# Altium project 盖革计数器.PrjPcb
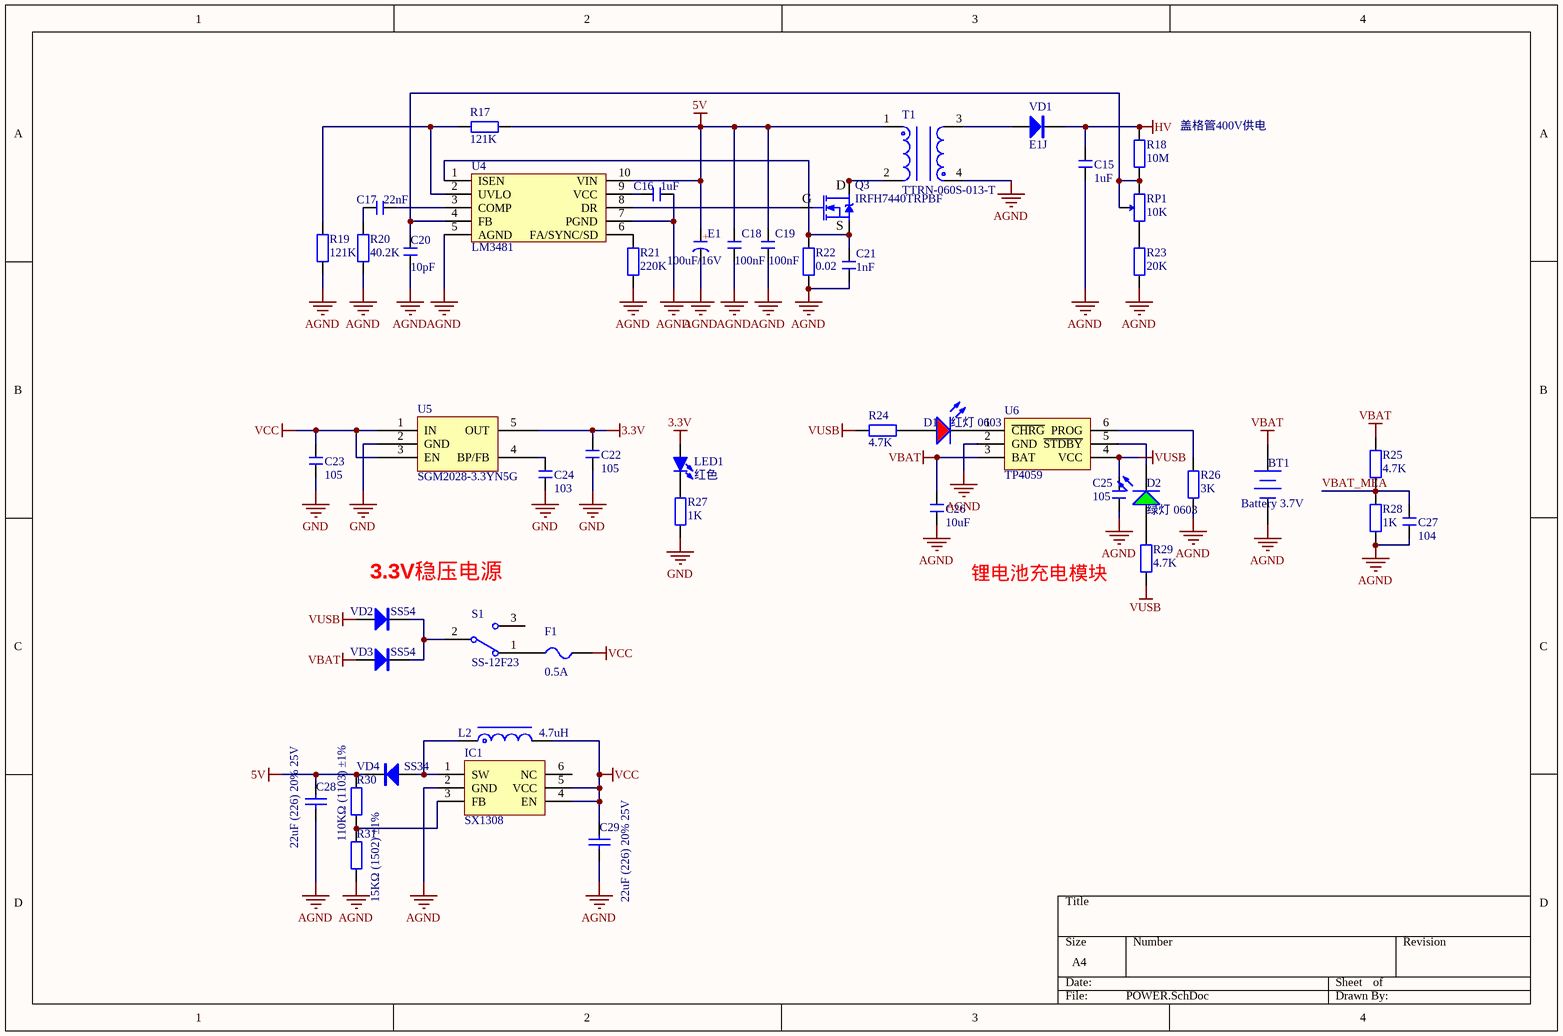
[diagram p0: POWER.SchDoc]
2 sheets, 95 parts. Net scope: global (net labels, ports and power ports of the same name join across sheets).
Board file: 盖革计数器.PcbDoc
Sheets:
  POWER.SchDoc
  CORE.SchDoc

## Sheet POWER.SchDoc
size A4

### Parts
BT1  Battery 3.7V  [BAT-2]
C15  1uF  [C 1812]
C16  1uF  [C 0603]
C17  22nF  [C 0603]
C18  100nF  [C 0603]
C19  100nF  [C 0603]
C20  10pF  [C 0603]
C21  1nF  [C 0603]
C22  105  [C 0603]
C23  105  [C 0603]
C24  103  [C 0603]
C25  105  [C 0603]
C26  10uF  [C 0805]
C27  104  [C 0603]
C28  22uF (226) 20% 25V  [0805_C]
C29  22uF (226) 20% 25V  [0805_C]
D1  红灯 0603  [0603_LED_S1]
D2  绿灯 0603  [0603_LED_S1]
E1  100uF/16V  [CM D(6.3*5.4)]
F1  0.5A  [FU 0805]
IC1  SX1308  [SOT23-6N]
L2  4.7uH  [L 04020]
LED1  红色  [LED 0603W]
Q3  IRFH7440TRPBF  [PQFN8_5X6_B_INF]
R17  121K  [R 0603]
R18  10M  [R 0603]
R19  121K  [R 0603]
R20  40.2K  [R 0603]
R21  220K  [R 0603]
R22  0.02  [R 0805]
R23  20K  [R 0603]
R24  4.7K  [R 0603]
R25  4.7K  [R 0603]
R26  3K  [R 0603]
R27  1K  [R 0603]
R28  1K  [R 0603]
R29  4.7K  [R 0603]
R30  110KΩ (1103) ±1%  [0603_R]
R31  15KΩ (1502) ±1%  [0603_R]
RP1  10K  [3303W]
S1  SS-12F23  [SS-12D07]
T1  TTRN-060S-013-T  [EE5.0]
U4  LM3481  [VSSOP10]
U5  SGM2028-3.3YN5G  [SOT23-5]
U6  TP4059  [SOT23-6_N]
VD1  E1J  [SOD-123F]
VD2  SS54  [SMA]
VD3  SS54  [SMA]
VD4  SS34  [SMA]

### Nets
3.3V: C22.2 LED1.1(A) U5.5(OUT)
5V: C18.2 C19.2 C28.2 E1.1(A) R17.1 R30.2 T1.1 U4.10(VIN) VD4.2(K)
AGND: BT1.2(-) C15.1 C16.2 C18.1 C19.1 C20.1 C21.1 C25.1 C26.1 C27.1 C28.1 C29.1 E1.2(K) IC1.2(GND) R19.1 R20.1 R21.1 R22.1 R23.1 R26.2 R28.1 R31.1 T1.4 U4.5(AGND) U4.7(PGND) U6.2(GND)
GND: C22.1 C23.1 C24.2 R27.2 U5.2(GND)
HV: C15.2 R18.2 VD1.2(K)
VBAT: BT1.1(+) C26.2 R25.2 U6.3(BAT) VD3.1(A)
VCC: C23.2 C29.2 F1.2 IC1.4(EN) IC1.5(VCC) L2.2 U5.1(IN) U5.3(EN)
VUSB: C25.2 R24.2 R29.2 U6.4(VCC) VD2.1(A)
VBAT_MEA: C27.2 R25.1 R28.2
NetC16_1: C16.1 U4.9(VCC)
NetC17_1: C17.1 R20.2
NetC17_2: C17.2 U4.3(COMP)
NetC20_2: C20.2 R18.1 RP1.1 RP1.2 U4.4(FB)
NetC21_2: C21.2 Q3.1(S) Q3.2(S) Q3.3(S) R22.2 U4.1(ISEN)
NetC24_1: C24.1 U5.4(BP/FB)
NetD1_A: D1.A R24.1
NetD1_K: D1.K U6.1(~{CHRG})
NetD2_A: D2.A R29.1
NetD2_K: D2.K U6.5(~{STDBY})
NetF1_1: F1.1 S1.1
NetIC1_1: IC1.1(SW) L2.1 VD4.1(A)
NetIC1_3: IC1.3(FB) R30.1 R31.2
NetLED1_2: LED1.2(K) R27.1
NetQ3_4: Q3.4(G) U4.8(DR)
NetQ3_5: Q3.5(D) Q3.6(D) Q3.7(D) Q3.8(D) T1.2
NetR17_2: R17.2 R19.2 U4.2(UVLO)
NetR21_2: R21.2 U4.6(FA/SYNC/SD)
NetR23_2: R23.2 RP1.3
NetR26_1: R26.1 U6.6(PROG)
NetS1_2: S1.2 VD2.2(K) VD3.2(K)
NetT1_3: T1.3 VD1.1(A)

Not connected (* = marked no-connect by the designer): IC1 6(NC); S1 3

### Notes on the sheet
- (near R18) 盖格管400V供电
- 3.3V稳压电源
- 锂电池充电模块
- (in symbol C-CM) +

### Library data of the parts
BT1 = Battery: Multicell Battery; Published: 24-Mar-1999; LatestRevisionDate: 17-Jul-2002; LatestRevisionNote: Re-released for DXP Platform.; PackageReference: BAT-2; Publisher: Altium Limited; PackageDescription: Battery; 2 Leads
C15-C27 = C: 无极性贴片电容; 版权归属: 源创客; BOM名称: 无极性贴片电容; 学习资源: www.ooocke.com
C28 C29 = 0805 22uF (226) 20% 25V: 贴片电容; ComponentLink1Description: 供应商链接; ComponentLink1URL: http://www.szlcsc.com/product/details_46786.html; Package: 0805; Supplier: LC; SuppliersPartNumber: C45783
D1 = 0603 红灯: 发光二极管; ComponentLink1Description: 供应商链接; ComponentLink1URL: http://www.szlcsc.com/product/details_2659.html; Package: 0603; Supplier: LC; SuppliersPartNumber: C2286
D2 = 0603 绿灯: 发光二极管; ComponentLink1Description: 供应商链接; ComponentLink1URL: http://www.szlcsc.com/product/details_73152.html; Package: 0603; Supplier: LC; SuppliersPartNumber: C72043
E1 = C-CM: 贴片电解电容; 版权归属: 源创客; BOM名称: 贴片电解电容; 学习资源: www.ooocke.com
F1 = FU: 贴片保险丝; 版权归属: 源创客; BOM名称: 贴片保险丝; 学习资源: www.ooocke.com
IC1 = SX1308: 可调升压芯片; 封装库来自淘宝卖家 ID：黄晶宝石: 其他店铺购入均为假冒，请立即申请退款，本店奖励2~5元现金; BOM名称: 可调升压芯片
L2 = L-CDRH: 功率屏蔽电感; 版权归属: 源创客; BOM名称: 功率屏蔽电感; 学习资源: www.ooocke.com
LED1 = LED-SMD: 贴片LED; 版权归属: 源创客; BOM名称: 贴片LED; 学习资源: www.ooocke.com
Q3 = IRFH7440TRPBF: 40V/159A N沟道MOS管
R17-R29 = R: 贴片电阻; 版权归属: 源创客; BOM名称: 贴片电阻; 学习资源: www.ooocke.com
R30 = 0603 110KΩ (1103) 1%: 贴片电阻; ComponentLink1Description: 供应商链接; ComponentLink1URL: http://www.szlcsc.com/product/details_26548.html; Package: 0603; Supplier: LC; SuppliersPartNumber: C25805
R31 = 0603 15KΩ (1502) 1%: 贴片电阻; ComponentLink1Description: 供应商链接; ComponentLink1URL: http://www.szlcsc.com/product/details_23536.html; Package: 0603; Supplier: LC; SuppliersPartNumber: C22809
RP1 = RP-SMD: 贴片电位器; 版权归属: 源创客; BOM名称: 贴片电位器; 学习资源: www.ooocke.com
S1 = SSW-1P: 1路拨动开关; BOM名称: 波动开关; 版权归属: 源创客; 学习资源: www.ooocke.com
T1 = TTRN-060S-013-T: 1:10.5 3.2A 贴片闪光灯变压器
U4 = LM3481: High-Efficiency Controller for Boost, SEPIC and Flyback DC-DC Converters
U5 = SGM2028-3.3YN5G: 500mA,3.3V低压差线性稳压器
U6 = TP4059: 600mA单节锂电池充电芯片
VD1 = E1J: 600V/1A 超快恢复二极管
VD2-VD4 = SS14: 肖特基二极管; 版权归属: 源创客; 属性: 40V/1A; BOM名称: 肖特基二极管; 学习资源: www.ooocke.com

## Sheet CORE.SchDoc
size A4
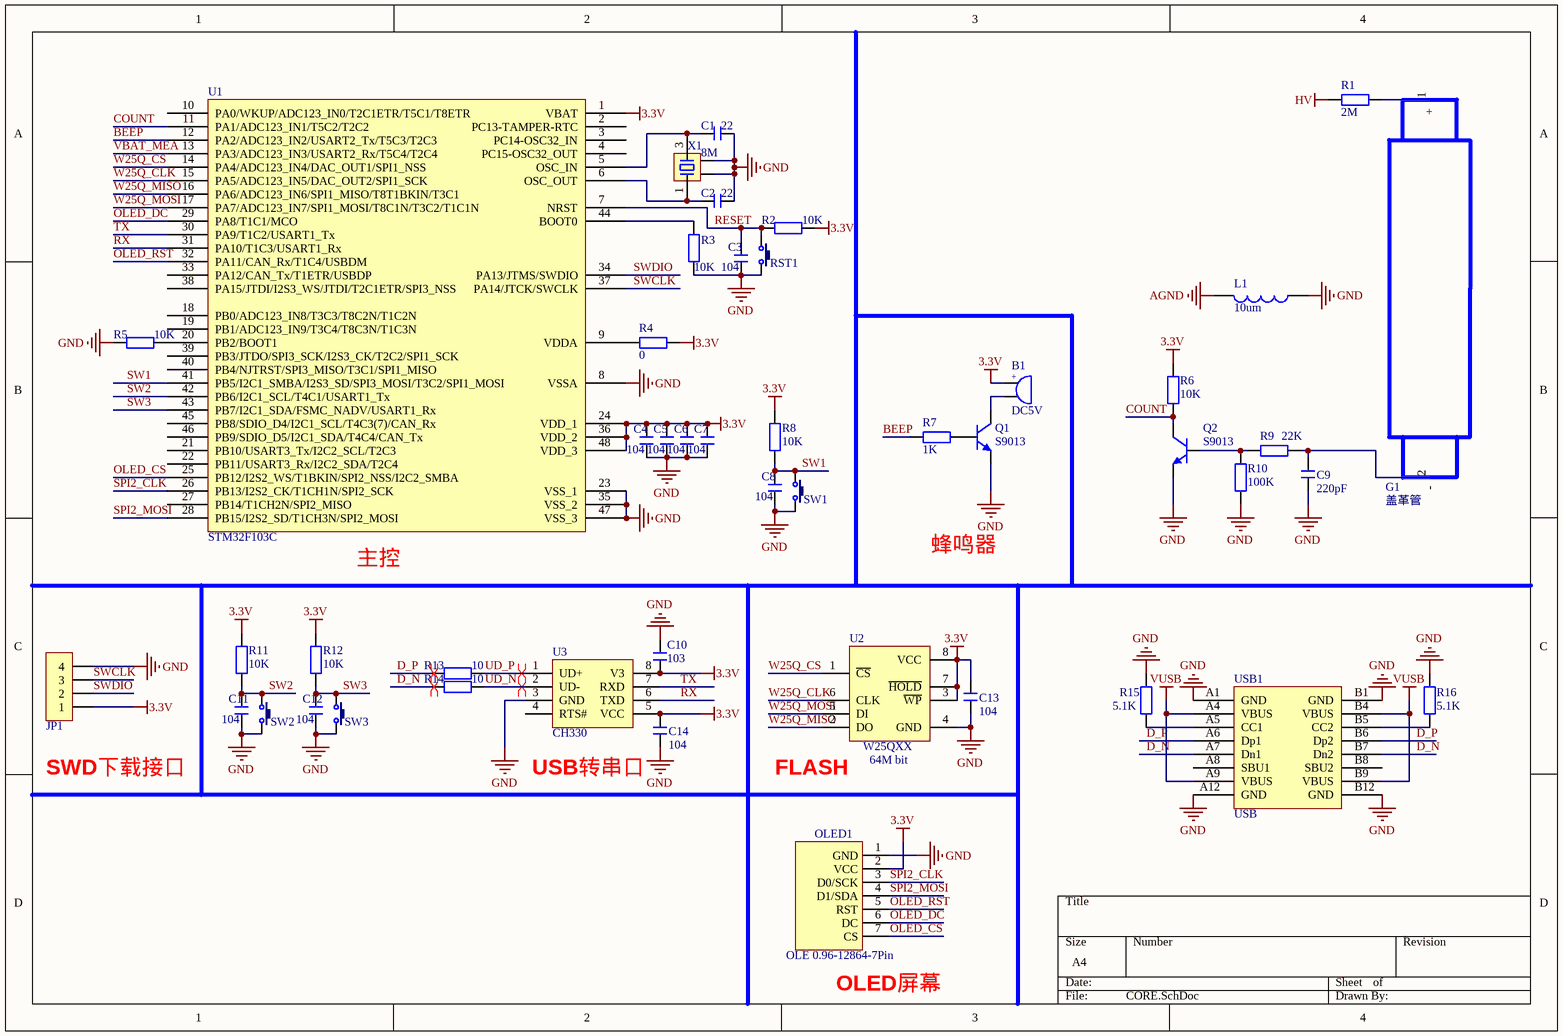
[diagram p1: CORE.SchDoc]

### Parts
B1  DC5V  [BEEP 5x9x5.5]
C1  22  [C 0603]
C2  22  [C 0603]
C3  104  [C 0603]
C4  104  [C 0603]
C5  104  [C 0603]
C6  104  [C 0603]
C7  104  [C 0603]
C8  104  [C 0603]
C9  220pF  [C 0603]
C10  103  [C 0603]
C11  104  [C 0603]
C12  104  [C 0603]
C13  104  [C 0603]
C14  104  [C 0603]
G1  盖革管  [SI3BG 2]
JP1  HDR-1X4  [SH1.0-4P-L]  (value not drawn)
L1  10um  [L 0805]
OLED1  OLE 0.96-12864-7Pin  [HDR-1X7_M]
Q1  S9013  [SOT23-3N]
Q2  S9013  [SOT23-3N]
R1  2M  [R 0603]
R2  10K  [R 0603]
R3  10K  [R 0603]
R4  0  [R 0603]
R5  10K  [R 0603]
R6  10K  [R 0603]
R7  1K  [R 0603]
R8  10K  [R 0603]
R9  22K  [R 0603]
R10  100K  [R 0603]
R11  10K  [R 0603]
R12  10K  [R 0603]
R13  10  [R 0603]
R14  10  [R 0603]
R15  5.1K  [R 0603]
R16  5.1K  [R 0603]
RST1  TSW  [TSW 2*4*3.5-S-W]  (value not drawn)
SW1  TSW  [TSW 2*4*3.5-S-W]  (value not drawn)
SW2  TSW  [TSW 2*4*3.5-S-W]  (value not drawn)
SW3  TSW  [TSW 2*4*3.5-S-W]  (value not drawn)
U1  STM32F103C  [LQFP-48_M]
U2  W25QXX  Memory: 64M bit  [SOIC8_W]
U3  CH330  [SOIC8_N]
USB1  USB  [USB-C/16P]
X1  8M  [XTAL-3225]

### Nets
3.3V: B1.1 C4.2 C5.2 C6.2 C7.2 C10.1 C13.2 C14.2 JP1.1 OLED1.2(VCC) R2.1 R4.1 R6.2 R8.1 R11.1 R12.1 U1.1(VBAT) U1.24(VDD_1) U1.36(VDD_2) U1.48(VDD_3) U2.3(~{WP}) U2.7(~{HOLD}) U2.8(VCC) U3.5(VCC) U3.8(V3)
AGND: L1.2
GND: C1.2 C2.2 C3.1 C4.1 C5.1 C6.1 C7.1 C8.1 C9.1 C10.2 C11.1 C12.1 C13.1 C14.1 JP1.4 L1.1 OLED1.1(GND) Q1.2(E) Q2.2(E) R3.1 R5.2 R10.1 R15.2 R16.2 RST1.1 SW1.1 SW2.1 SW3.1 U1.8(VSSA) U1.23(VSS_1) U1.35(VSS_2) U1.47(VSS_3) U2.4(GND) U3.3(GND) USB1.A1(GND) USB1.A12(GND) USB1.B1(GND) USB1.B12(GND) X1.2 X1.4
HV: R1.1
VUSB: USB1.A4(VBUS) USB1.A9(VBUS) USB1.B4(VBUS) USB1.B9(VBUS)
BEEP: R7.2 U1.12(PA2/ADC123_IN2/USART2_Tx/T5C3/T2C3)
COUNT: Q2.3(C) R6.1 U1.11(PA1/ADC123_IN1/T5C2/T2C2)
D_N: R14.1 USB1.A7(Dn1) USB1.B7(Dn2)
D_P: R13.1 USB1.A6(Dp1) USB1.B6(Dp2)
OLED_CS: OLED1.7(CS) U1.25(PB12/I2S2_WS/T1BKIN/SPI2_NSS/I2C2_SMBA)
OLED_DC: OLED1.6(DC) U1.29(PA8/T1C1/MCO)
OLED_RST: OLED1.5(RST) U1.32(PA11/CAN_Rx/T1C4/USBDM)
RESET: C3.2 R2.2 RST1.2 U1.7(NRST)
RX: U1.31(PA10/T1C3/USART1_Rx) U3.6(TXD)
SPI2_CLK: OLED1.3(D0/SCK) U1.26(PB13/I2S2_CK/T1CH1N/SPI2_SCK)
SPI2_MOSI: OLED1.4(D1/SDA) U1.28(PB15/I2S2_SD/T1CH3N/SPI2_MOSI)
SW1: C8.2 R8.2 SW1.2 U1.41(PB5/I2C1_SMBA/I2S3_SD/SPI3_MOSI/T3C2/SPI1_MOSI)
SW2: C11.2 R11.2 SW2.2 U1.42(PB6/I2C1_SCL/T4C1/USART1_Tx)
SW3: C12.2 R12.2 SW3.2 U1.43(PB7/I2C1_SDA/FSMC_NADV/USART1_Rx)
SWCLK: JP1.3 U1.37(PA14/JTCK/SWCLK)
SWDIO: JP1.2 U1.34(PA13/JTMS/SWDIO)
TX: U1.30(PA9/T1C2/USART1_Tx) U3.7(RXD)
UD_N: R14.2 U3.2(UD-)
UD_P: R13.2 U3.1(UD+)
VBAT_MEA: U1.13(PA3/ADC123_IN3/USART2_Rx/T5C4/T2C4)
W25Q_CLK: U1.15(PA5/ADC123_IN5/DAC_OUT2/SPI1_SCK) U2.6(CLK)
W25Q_CS: U1.14(PA4/ADC123_IN4/DAC_OUT1/SPI1_NSS) U2.1(~{CS})
W25Q_MISO: U1.16(PA6/ADC123_IN6/SPI1_MISO/T8T1BKIN/T3C1) U2.2(DO)
W25Q_MOSI: U1.17(PA7/ADC123_IN7/SPI1_MOSI/T8C1N/T3C2/T1C1N) U2.5(DI)
NetB1_2: B1.2 Q1.3(C)
NetC1_1: C1.1 U1.5(OSC_IN) X1.3
NetC2_1: C2.1 U1.6(OSC_OUT) X1.1
NetC9_2: C9.2 G1.2(-) R9.1
NetG1_1: G1.1(+) R1.2
NetQ1_1: Q1.1(B) R7.1
NetQ2_1: Q2.1(B) R9.2 R10.2
NetR3_2: R3.2 U1.44(BOOT0)
NetR4_2: R4.2 U1.9(VDDA)
NetR5_1: R5.1 U1.20(PB2/BOOT1)
NetR15_1: R15.1 USB1.A5(CC1)
NetR16_1: R16.1 USB1.B5(CC2)

Not connected (* = marked no-connect by the designer): U1 2(PC13-TAMPER-RTC) 3(PC14-OSC32_IN) 4(PC15-OSC32_OUT) 10(PA0/WKUP/ADC123_IN0/T2C1ETR/T5C1/T8ETR) 18(PB0/ADC123_IN8/T3C3/T8C2N/T1C2N) 19(PB1/ADC123_IN9/T3C4/T8C3N/T1C3N) 21(PB10/USART3_Tx/I2C2_SCL/T2C3) 22(PB11/USART3_Rx/I2C2_SDA/T2C4) 27(PB14/T1CH2N/SPI2_MISO) 33(PA12/CAN_Tx/T1ETR/USBDP) 38(PA15/JTDI/I2S3_WS/JTDI/T2C1ETR/SPI3_NSS) 39(PB3/JTDO/SPI3_SCK/I2S3_CK/T2C2/SPI1_SCK) 40(PB4/NJTRST/SPI3_MISO/T3C1/SPI1_MISO) 45(PB8/SDIO_D4/I2C1_SCL/T4C3(7)/CAN_Rx) 46(PB9/SDIO_D5/I2C1_SDA/T4C4/CAN_Tx); U3 4(RTS#); USB1 A8(SBU1) B8(SBU2)

### Layout directives
differential pair: D_N, D_P, UD_N, UD_P

### Notes on the sheet
- (near U1) 主控
- 蜂鸣器
- (near JP1) SWD下载接口
- USB转串口
- (near U2) FLASH
- (near OLED1) OLED屏幕
- (in symbol BEEP) +

### Library data of the parts
B1 = BEEP: 蜂鸣器; 版权归属: 源创客; BOM名称: 蜂鸣器; 学习资源: www.ooocke.com
C1-C14 = C: 无极性贴片电容; 版权归属: 源创客; BOM名称: 无极性贴片电容; 学习资源: www.ooocke.com
G1 = 盖革管: 小型高量程SI3BG GM管
JP1 = Header 4: 4P接插件; 版权归属: 源创客; BOM名称: 4P接插件; 学习资源: www.ooocke.com
L1 = L: 小功率贴片电感; 版权归属: 源创客; BOM名称: 小功率贴片电感; 学习资源: www.ooocke.com
Q1 Q2 = 9013-SMD: 低频放大-NPN型; 版权归属: 源创客; 属性: 50V 0.5A 0.625W; BOM名称: 低频放大-NPN型; 学习资源: www.ooocke.com
R1-R16 = R: 贴片电阻; 版权归属: 源创客; BOM名称: 贴片电阻; 学习资源: www.ooocke.com
RST1 SW1-SW3 = TSW SMD: 轻触开关; BOM名称: 3x6轻触开关; 版权归属: 源创客; 学习资源: www.ooocke.com
U1 = STM32F103C: STM32单片机48引脚
U2 = W25QXX: SPI FLASH
USB1 = USB-C/16P: USB-C型母口16P/12P
X1 = XTAL-4: 4脚晶振; 版权归属: 源创客; BOM名称: 4脚晶振; 学习资源: www.ooocke.com

## Nets that join several sheets
3.3V: POWER (C22.2 LED1.1 U5.5), CORE (25 pins)
AGND: POWER (26 pins), CORE (L1.2)
GND: POWER (5 pins), CORE (40 pins)
HV: POWER (C15.2 R18.2 VD1.2), CORE (R1.1)
VUSB: POWER (5 pins), CORE (USB1.A4 USB1.A9 USB1.B4 USB1.B9)
VBAT_MEA: POWER (C27.2 R25.1 R28.2), CORE (U1.13)